# EAGLE design usb-can (EAGLE 9.3.0)
CNAME: Institudo Politecnico de Leiria; CREVISION: 1a; DESIGNER: Joao Silva
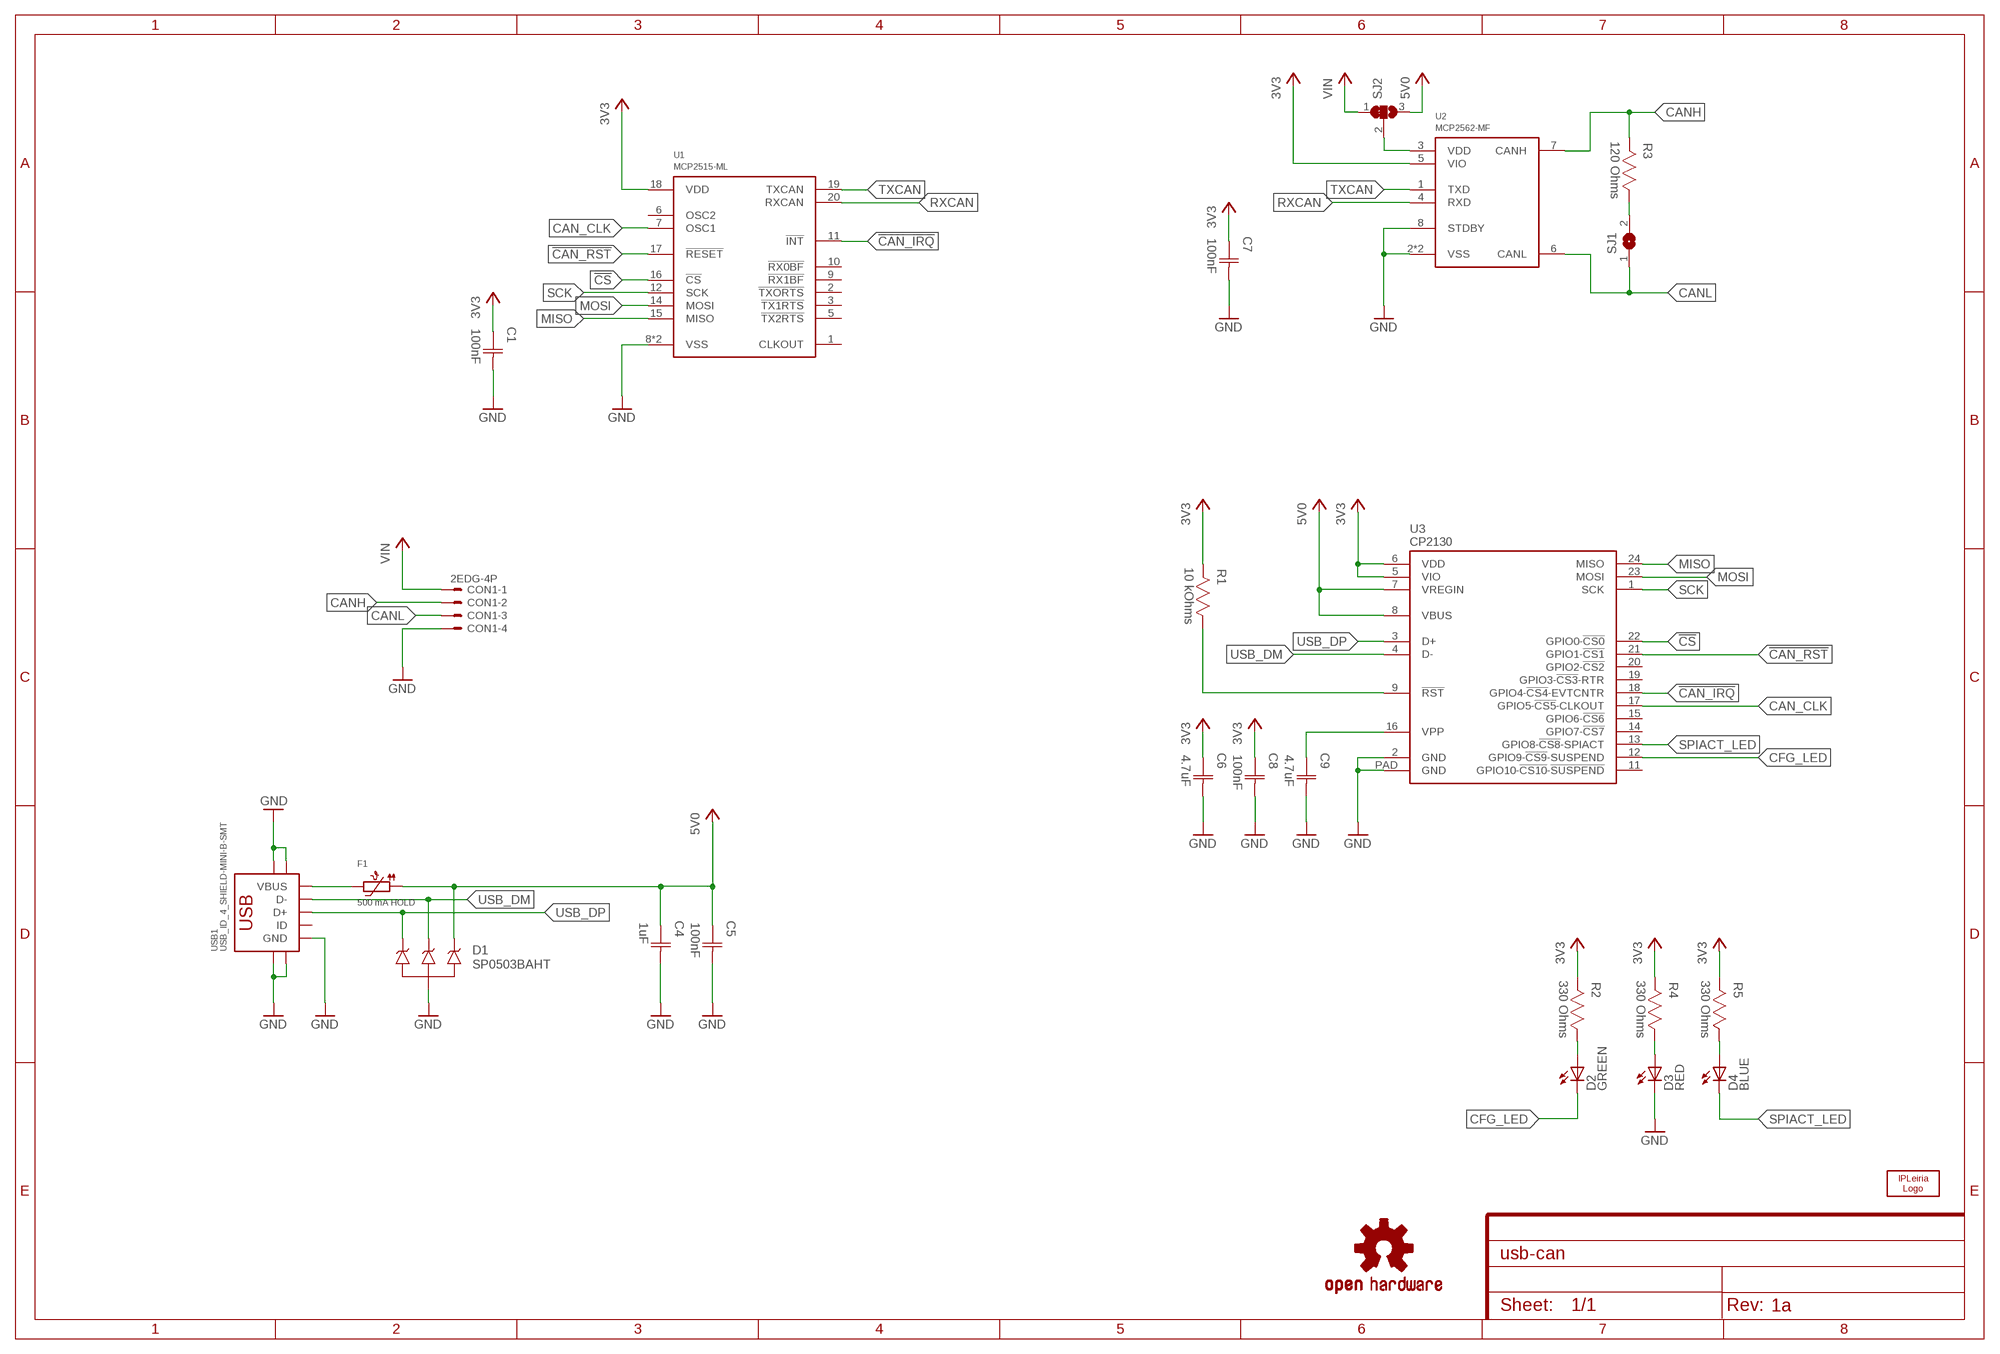
[diagram p0: schematic, sheet 1]

## Parts
C1  100nF  CAPACITOR-0603  [CAP0603]
C4  1uF  CAPACITOR-0603  [CAP0603]
C5  100nF  CAPACITOR-0603  [CAP0603]
C6  4.7uF  CAPACITOR-0603  [CAP0603]
C7  100nF  CAPACITOR-0603  [CAP0603]
C8  100nF  CAPACITOR-0603  [CAP0603]
C9  4.7uF  CAPACITOR-0603  [CAP0603]
CON1  2EDG-4P  [2EDG-4P]
D1  SP0503BAHT  [SOT143]
D2  GREEN  LED0603  [0603]
D3  RED  LED0603  [0603]
D4  BLUE  LED0603  [0603]
F1  500 mA HOLD  PTC1206  [1206]
LOGO1  IPL-10MM  [IPL_10MM]
LOGO2  OSHW-LOGOM  [OSHW-LOGO-M]
R1  10 kOhms  RESISTOR-0603  [RES0603]
R2  330 Ohms  RESISTOR-0603  [RES0603]
R3  120 Ohms  RESISTOR-0603  [RES0603]
R4  330 Ohms  RESISTOR-0603  [RES0603]
R5  330 Ohms  RESISTOR-0603  [RES0603]
SJ1  SJS  [SJ_S]
SJ2  SJ2CS  [SJ2C_S]
U1  MCP2515-ML  [QFN20]
U2  MCP2562-MF  [DFN8]
U3  CP2130  [QFN24]
USB1  USB_ID_4_SHIELD-MINI-B-SMT  [USB-MB-S]

## Nets
3V3: C1.1(C1) C6.1(C1) C7.1(C1) C8.1(C1) R1.2 R2.2 R4.2 R5.2 U1.18(VDD) U2.5(VIO) U3.5(VIO) U3.6(VDD)
5V0: C4.1(C1) C5.1(C1) D1.4 F1.1 SJ2.3 U3.7(VREGIN) U3.8(VBUS)
!CAN_IRQ: U1.11(!INT!) U3.18(GPIO4-!CS4!-EVTCNTR)
!CAN_RST: U1.17(!RESET!) U3.21(GPIO1-!CS1)
!CS: U1.16(!CS!) U3.22(GPIO0-!CS0)
CAN_CLK: U1.7(OSC1) U3.17(GPIO5-!CS5!-CLKOUT)
CANH: CON1.P$2 R3.2 U2.7(CANH)
CANL: CON1.P$3 SJ1.1 U2.6(CANL)
CFG_LED: D2.1(C) U3.12(GPIO9-!CS9!-SUSPEND)
GND: C1.2(C2) C4.2(C2) C5.2(C2) C6.2(C2) C7.2(C2) C8.2(C2) C9.2(C2) CON1.P$4 D1.1 D3.1(C) U1.8(VSS) U1.PAD(VSS) U2.2(VSS) U2.8(STDBY) U2.9(VSS) U3.2(GND) U3.PAD(GND) USB1.GND USB1.GND1(SHIELD) USB1.GND2(SHIELD) USB1.GND3(SHIELD) USB1.GND4(SHIELD)
MISO: U1.15(MISO) U3.24(MISO)
MOSI: U1.14(MOSI) U3.23(MOSI)
N$1: SJ2.2 U2.3(VDD)
N$3: R3.1 SJ1.2
N$4: C9.1(C1) U3.16(VPP)
N$5: R1.1 U3.9(!RST)
N$6: F1.2 USB1.VBUS
N$7: D3.2(A) R4.1
N$8: D4.2(A) R5.1
N$9: D2.2(A) R2.1
RXCAN: U1.20(RXCAN) U2.4(RXD)
SCK: U1.12(SCK) U3.1(SCK)
SPIACT_LED: D4.1(C) U3.13(GPIO8-!CS8!-SPIACT)
TXCAN: U1.19(TXCAN) U2.1(TXD)
USB_DM: D1.3 U3.4(D-) USB1.D-
USB_DP: D1.2 U3.3(D+) USB1.D+
VIN: CON1.P$1 SJ2.1
Unconnected: U1.1(CLKOUT) U1.2(!TXORTS!) U1.3(!TX1RTS!) U1.5(!TX2RTS!) U1.6(OSC2) U1.9(!RX1BF!) U1.10(!RX0BF!) U3.11(GPIO10-!CS10!-!SUSPEND) U3.14(GPIO7-!CS7) U3.15(GPIO6-!CS6) U3.19(GPIO3-!CS3!-RTR) U3.20(GPIO2-!CS2) USB1.ID

## Library data of the parts
C1 C4-C9 = Capacitor:CAPACITOR
CON1 = Generic Connector:2EDG-4P
D1 = TVS:SP0503BAHT
D2-D4 = LED:LED
F1 = PTC Fuses:PTC
LOGO1 = Silkscreen:IPL
LOGO2 = Silkscreen:OSHW-LOGO: Open-Source Hardware (OSHW) Logo This logo indicates the piece of hardware it is found on incorporates a OSHW license and/or adheres to the definition of open source hardware found here: http://freedomdefined.org/OSHW
R1-R5 = Resistor:RESISTOR
SJ1 = Solder Jumper:SJ
SJ2 = Solder Jumper:SJ2C
U1 = Microchip:MCP2515
U2 = Microchip:MCP2562
U3 = Silicon Labs:CP2130
USB1 = USB Connector:USB_ID_4_SHIELD

## Board
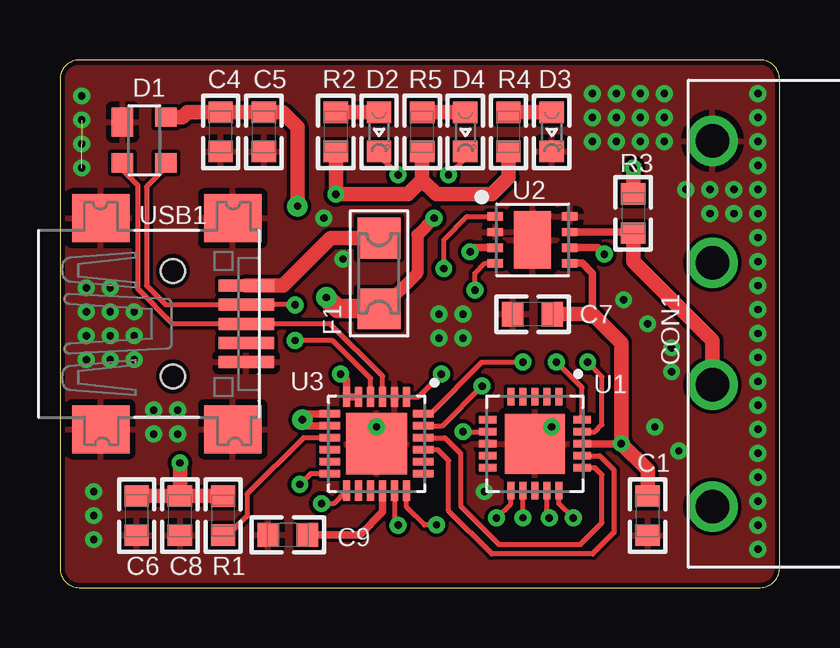
[diagram p1: board, top side]
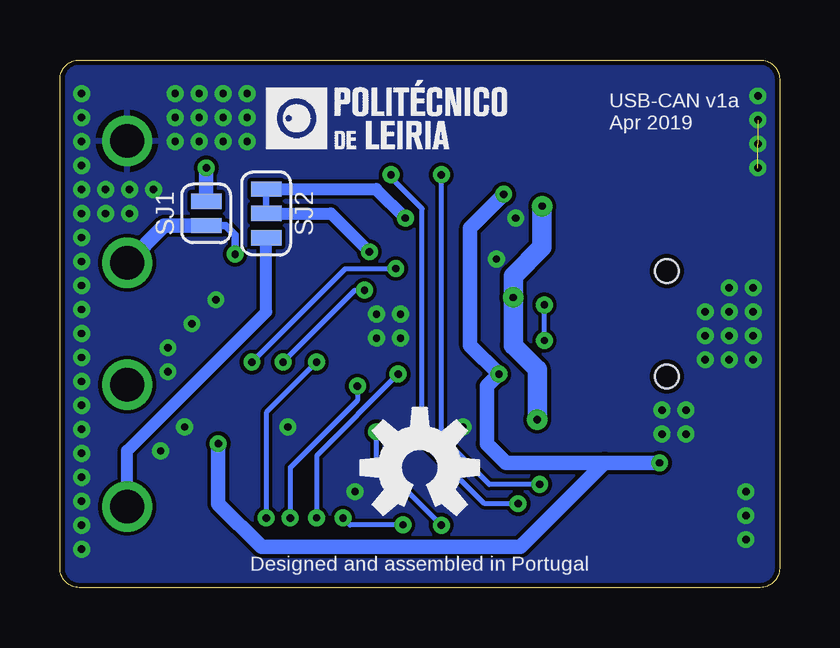
[diagram p2: board, bottom side, seen from below]

Size 30 x 22 mm. Coordinates in mm from the lower left corner, seen from the top.
Outline: 0,21.2 0,0.8 arc90 0.8,0 29.2,0 arc90 30,0.8 30,21.2 arc90 29.2,22 0.8,22 arc90 0,21.2
Copper layers (1*16): Top 0.035mm / dielectric 1.5mm / Bottom 0.035mm
Design rules "default": minimum track width 6mil, minimum drill 0.3mm, track to track 6mil, track to pad 6mil, pad to pad 6mil, via to via 6mil, smd to smd 6mil, copper to edge 0.2mm, drill to drill 6mil, minimum pad ring 10mil, minimum via ring 8mil, stop-mask expansion 4mil, vias tented up to drill 50mil, thermal gap 10mil

### Footprints (pad centres in the part's own frame; a part is rotated, then mirrored left to right if it is on the bottom)
CAP0603 = smd 0.889 x 1.016: 1 -0.819,0; 2 0.819,0
2EDG-4P = drill 1.4: P$1 -7.62,0; P$2 -2.54,0; P$3 2.54,0; P$4 7.62,0
SOT143 = smd 1.2 x 0.9: 1 -0.711,-0.889 | smd 0.8 x 0.9: 2 0.989,-0.889; 3 0.989,0.911; 4 -0.911,0.911
0603 = smd 0.889 x 1.016: 1 -0.819,0; 2 0.819,0
1206 = smd 1.7 x 1.803: 1 -1.472,0; 2 1.472,0
RES0603 = smd 0.889 x 1.016: 1 -0.819,0; 2 0.819,0
SJ_S = smd 0.635 x 1.27: 1 -0.508,0; 2 0.508,0
SJ2C_S = smd 0.635 x 1.27: 1 -1.016,0; 2 0,0; 3 1.016,0
QFN20 = smd 0.73 x 0.3: 1 -1.965,1; 2 -1.965,0.5; 3 -1.965,0; 4 -1.965,-0.5; 5 -1.965,-1; 11 1.965,-1; 12 1.965,-0.5; 13 1.965,0; 14 1.965,0.5; 15 1.965,1 | smd 0.3 x 0.73: 6 -1,-1.965; 7 -0.5,-1.965; 8 0,-1.965; 9 0.5,-1.965; 10 1,-1.965; 16 1,1.965; 17 0.5,1.965; 18 0,1.965; 19 -0.5,1.965; 20 -1,1.965 | smd 2.5 x 2.5: PAD 0,0
DFN8 = smd 0.65 x 0.35: 1 -1.55,0.975; 2 -1.55,0.325; 3 -1.55,-0.325; 4 -1.55,-0.975; 5 1.55,-0.975; 6 1.55,-0.325; 7 1.55,0.325; 8 1.55,0.975 | smd 1.55 x 2.4: 9 0,0
QFN24 = smd 0.3 x 0.85: 1 -1.25,-1.95; 2 -0.75,-1.95; 3 -0.25,-1.95; 4 0.25,-1.95; 5 0.75,-1.95; 6 1.25,-1.95; 13 1.25,1.95; 14 0.75,1.95; 15 0.25,1.95; 16 -0.25,1.95; 17 -0.75,1.95; 18 -1.25,1.95 | smd 0.85 x 0.3: 7 1.95,-1.25; 8 1.95,-0.75; 9 1.95,-0.25; 10 1.95,0.25; 11 1.95,0.75; 12 1.95,1.25; 19 -1.95,1.25; 20 -1.95,0.75; 21 -1.95,0.25; 22 -1.95,-0.25; 23 -1.95,-0.75; 24 -1.95,-1.25 | smd 2.55 x 2.55: PAD 0,0
USB-MB-S = smd 0.5 x 2.308: D+ 0,4.064; D- -0.8,4.064; GND 1.6,4.064; ID 0.8,4.064; VBUS -1.6,4.064 | smd 2 x 2.4: GND1 -4.4,-2; GND2 -4.4,3.5; GND3 4.4,3.5; GND4 4.4,-2 | hole 1: -2.2,1; 2.2,1

### Placement (x,y rotation side)
C1  24.5,3 270 top
C4  6.7,19 270 top
C5  8.5,19 270 top
C6  3.2,3 270 top
C7  19.7,11.4 180 top
C8  5,3 270 top
C9  9.5,2.2 180 top
CON1  27.2,11 90 top
D1  3.5,18.7 270 top
D2  13.3,19 90 top
D3  20.5,19 90 top
D4  16.9,19 90 top
F1  13.3,13.1 90 top
LOGO1  21.4,18.3 0 bottom
LOGO2  15,5 0 bottom
R1  6.8,3 90 top
R2  11.5,19 270 top
R3  23.9,15.6 270 top
R4  18.7,19 270 top
R5  15.1,19 270 top
SJ1  23.9,15.6 90 bottom
SJ2  21.4,15.6 90 bottom
U1  19.8,6 270 top
U2  19.7,14.5 0 top
U3  13.2,6 180 top
USB1  3.7,11 270 top

### Tracks (layer width: path | path; a pad name or v marks a point on that pad's centre or on a via)
3V3  (via drill 0.3)
  Top 0.305: v11.7,8.9 11.95,8.65 U3.6 U3.5 | U1.18 v23.4,6 | 22.2,11.4 22.2,13.1 21.77,13.53 U2.5
  Top 0.61: 3.72,3.82 C6.1 C8.1 | R1.2 C8.1 | v5,5.2 C8.1 | C1.1 24.5,4.9 v23.4,6 23.4,10.2 22.2,11.4 C7.1 | R2.2 v11.5,16.4 14.5,16.4 15.1,17 | 15.1,17 R5.2 | 15.1,17 15.7,16.4 18,16.4 18.7,17.1 R4.2
  Bottom 0.61: 7.3,5.2 11.4,5.2 12.2,6 12.2,8.4 v11.7,8.9 12.9,10.1 12.9,15 v11.5,16.4 | 7.3,5.2 v5,5.2 | v23.4,6 23.4,3.5 21.6,1.7 10.8,1.7 7.3,5.2
5V0  (via drill 0.3, 0.3 pad 0.85)
  Top 0.305: U3.7 10.35,7.25 v10.1,7 10.35,6.75 U3.8
  Top 0.508: v15.6,15.4 14.9,14.7 14.9,13.1 13.43,11.63 F1.1
  Top 0.61: D1.4 5.11,19.61 5.32,19.82 C4.1 C5.1 9.28,19.82 9.9,19.2 v9.9,15.9
  Top 0.813: F1.1 11.57,11.63 v11.1,12.1
  Bottom 0.508: SJ2.3 16.82,16.62 v15.6,15.4
  Bottom 0.813: v10.1,7 10.1,9.1 11.1,10.1 v11.1,12.1 11.1,13 9.9,14.2 v9.9,15.9
!CAN_IRQ  (via drill 0.3)
  Top 0.2: v18.2,2.9 18.8,3.5 U1.11 | v15.7,2.61 15.19,2.61 14.45,3.35 U3.18
  Bottom 0.2: v15.7,2.61 17.91,2.61 v18.2,2.9
!CAN_RST
  Top 0.2: U1.17 22.5,5.5 23.1,4.9 23.1,2.3 22.2,1.4 18,1.4 16.2,3.2 16.2,5.3 15.75,5.75 U3.21
!CS
  Top 0.2: U3.22 16.05,6.25 16.7,5.6 16.7,3.4 18.3,1.8 21.7,1.8 22.6,2.7 22.6,4.7 22.3,5 U1.16
CAN_CLK  (via drill 0.3)
  Top 0.2: U3.17 13.95,2.75 v14.1,2.6 | v16.8,6.5 U1.7
  Bottom 0.2: v14.1,2.6 16.8,5.3 v16.8,6.5
CANH
  Top 0.305: U2.7 23.86,14.82 R3.2
  Top 0.61: R3.2 23.9,13.6 27.2,10.3 CON1.P$2
CANL  (via drill 0.3)
  Top 0.305: U2.6 22.43,14.18 v22.7,13.9
  Bottom 0.305: v22.7,13.9 22.7,14.7 23.09,15.09 SJ1.1
  Bottom 0.61: CON1.P$3 25.65,15.09 SJ1.1
CFG_LED  (via drill 0.3)
  Top 0.2: U3.12 10.45,4.75 v10,4.3 | v14.1,17.21 13.3,18.01 D2.1
  Bottom 0.2: v10,4.3 12.1,4.3 14.1,6.3 v14.1,17.21
GND  (via drill 0.3)  (2 unrouted)
  other vias: 17.7,4 20.5,6.7 13.2,6.7 29.1,4.6 29.1,3.6 29.1,2.6 29.1,1.6 29.1,8.6 29.1,7.6 29.1,6.6 29.1,5.6 29.1,12.6 29.1,11.6 29.1,10.6 29.1,9.6 29.1,16.6 29.1,15.6 29.1,14.6 29.1,13.6 29.1,20.6 29.1,19.6 29.1,18.6 29.1,17.6 22.2,18.6 23.2,18.6 24.2,18.6 25.2,18.6 22.2,19.6 23.2,19.6 24.2,19.6 25.2,19.6 22.2,20.6 23.2,20.6 24.2,20.6 25.2,20.6 23.5,12 25.5,9 25.5,10 24.5,11 24.8,6.7 25.8,5.7 15.8,10.4 16.8,10.4 15.8,11.4 16.8,11.4 3.1,9.5 3.1,10.5 3.1,11.5 2.1,9.5 2.1,10.5 2.1,11.5 2.1,12.5 1.1,9.5 1.1,10.5 1.1,11.5 1.1,12.5 1.4,2 1.4,3 1.4,4 4.9,6.4 4.9,7.4 3.9,6.4 3.9,7.4 11,15.4 26.1,16.6 27.1,16.6 27.1,15.6 28.1,16.6 28.1,15.6 11.8,13.7 0.9,20.5 0.9,19.5 0.9,18.5 0.9,17.5
  pour Top: -1.7,23.7 32.2,23.7 32.2,-1.6 -1.7,-1.6
  pour Bottom: -3.7,25.4 34.8,25.4 34.8,-3.7 -3.7,-3.7
MISO  (via drill 0.3)
  Top 0.2: U3.24 15.45,7.25 17.6,9.4 v19.3,9.4 | v21.4,2.9 20.8,3.5 U1.15
  Bottom 0.2: v19.3,9.4 21.4,7.3 v21.4,2.9
MOSI  (via drill 0.3)
  Top 0.2: U3.23 15.95,6.75 v17.6,8.4 | v20.4,2.9 20.3,3 U1.14
  Bottom 0.2: v17.6,8.4 17.6,7.8 20.4,5 v20.4,2.9
N$1  (via drill 0.3)
  Top 0.305: v17.1,14 17.27,14.18 U2.3
  Bottom 0.508: SJ2.2 18.7,15.6 v17.1,14
N$3  (via drill 0.3)
  Top 0.61: v23.9,17.5 R3.1
  Bottom 0.61: SJ1.2 v23.9,17.5
N$4
  Top 0.305: C9.1 12.5,2.2 13.45,3.15 U3.16
N$5
  Top 0.2: U3.9 10.15,6.25 7.8,3.9 7.8,3 6.98,2.18 R1.1
N$6
  Top 0.61: USB1.VBUS 9.3,12.6 11.27,14.57 F1.2
N$7
  Top 0.61: R4.1 D3.2
N$8
  Top 0.61: D4.2 R5.1
N$9
  Top 0.61: R2.1 D2.2
RXCAN  (via drill 0.3)
  Top 0.2: U1.20 21.77,8.34 v20.7,9.4 | v17.3,12.4 17.3,13.1 17.73,13.53 U2.4
  Bottom 0.2: v20.7,9.4 17.7,12.4 v17.3,12.4
SCK  (via drill 0.3)
  Top 0.2: U3.1 14.95,7.95 v15.9,8.9 | v19.3,2.91 U1.12
  Bottom 0.2: v15.9,8.9 19.3,5.5 v19.3,2.91
SPIACT_LED  (via drill 0.3)
  Top 0.2: U3.13 11.4,3.5 v10.9,3.5 | v16.2,17.21 16.9,17.91 D4.1
  Bottom 0.2: v10.9,3.5 12.3,3.5 14.9,6.1 14.9,15.8 16.2,17.1 v16.2,17.21
TXCAN  (via drill 0.3)
  Top 0.2: U1.19 22.3,6.5 22.6,6.8 22.6,8.8 v22,9.4 | v16,13.3 16,14.5 16.98,15.47 U2.1
  Bottom 0.2: v22,9.4 18.1,13.3 v16,13.3
USB_DM  (via drill 0.3)
  Top 0.2: U3.4 12.95,8.72 11.37,10.3 v9.8,10.3 | v9.8,11.79 v9.79,11.8 USB1.D- 4.4,11.8 3.61,12.59 3.61,16.71 4.41,17.51 D1.3
  Bottom 0.2: v9.8,10.3 v9.8,11.79 v9.8,11.8
USB_DP
  Top 0.2: U3.3 13.45,8.82 11.27,11 USB1.D+ 4.7,11 3.26,12.44 3.26,16.76 2.61,17.41 D1.2
VIN
  Bottom 0.508: CON1.P$1 27.2,5.7 21.4,11.5 SJ2.1

### Text on the board
bPlace: USB-CAN v1a / Apr 2019 | Designed and assembled in Portugal